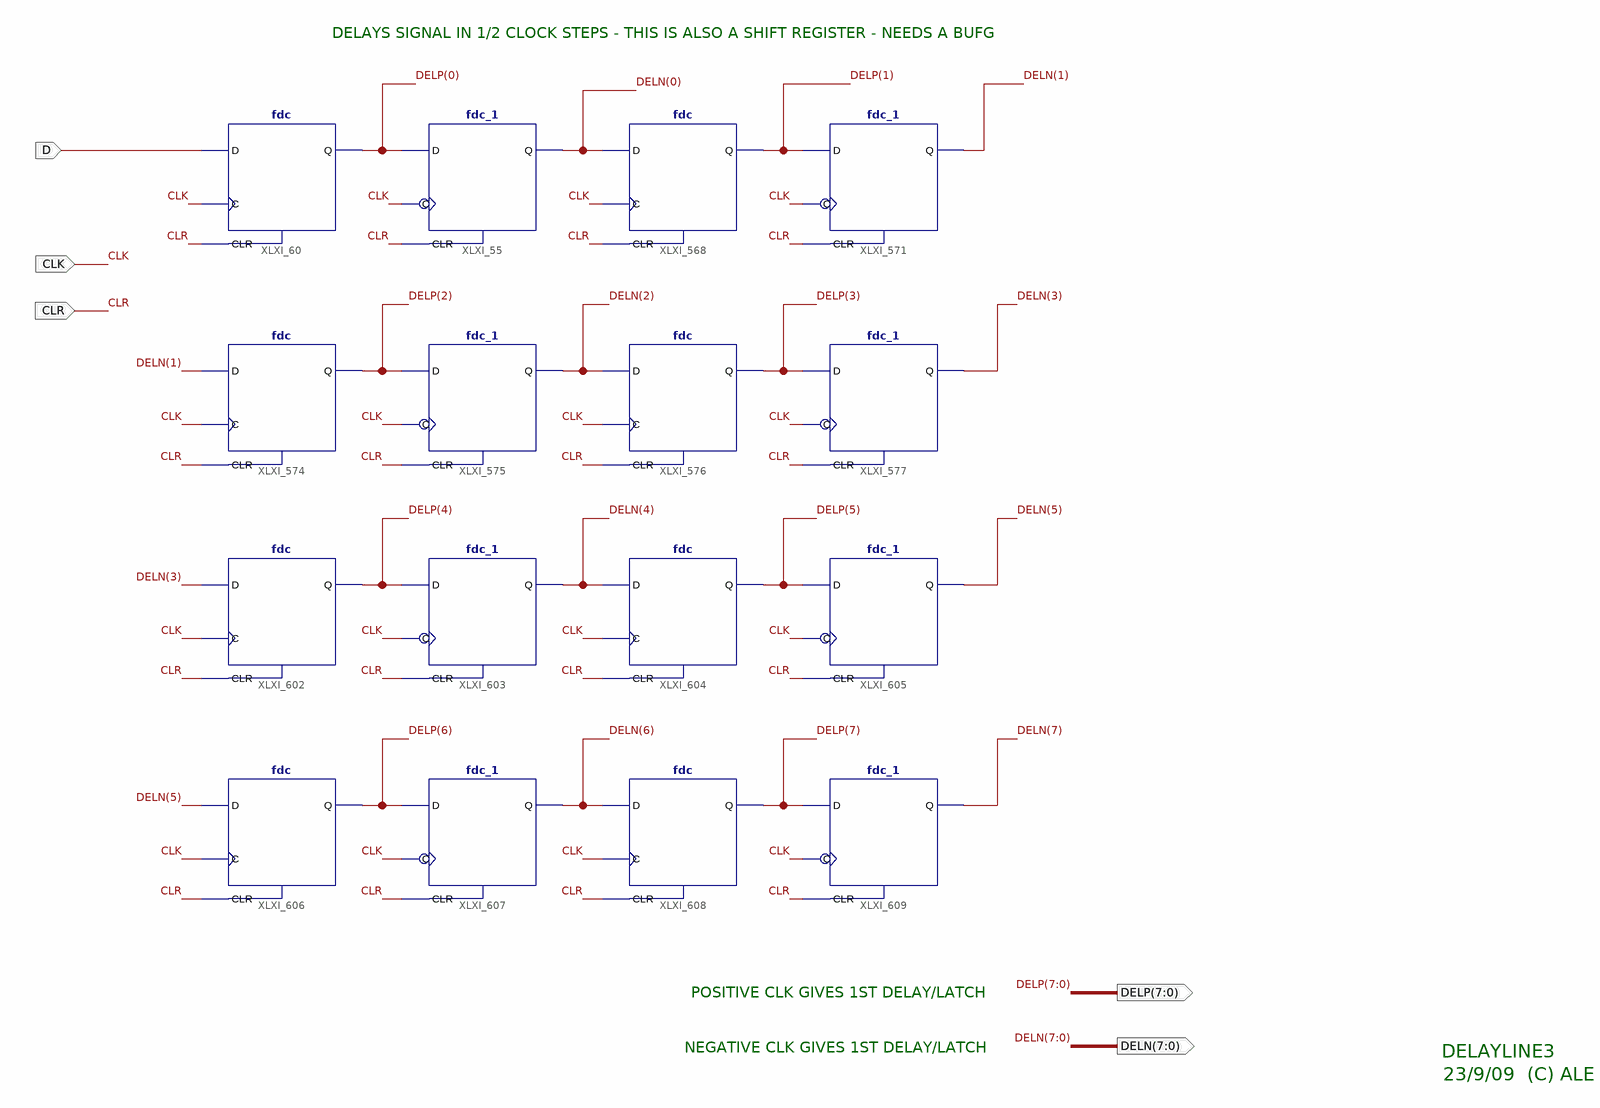
[diagram p0: schematic sheet 1]
// Xilinx ISE schematic DB_DelayLine3.sch (spartan3e) as structural Verilog: 16 symbols, 5 ports
module DB_DelayLine3 (
  input  CLK,
  input  CLR,
  input  D,
  output [7:0] DELP,
  output [7:0] DELN
);

  fdc XLXI_60 (.C(CLK), .CLR(CLR), .D(D), .Q(DELP[0]));
  fdc XLXI_568 (.C(CLK), .CLR(CLR), .D(DELN[0]), .Q(DELP[1]));
  fdc_1 XLXI_55 (.C(CLK), .CLR(CLR), .D(DELP[0]), .Q(DELN[0]));
  fdc_1 XLXI_571 (.C(CLK), .CLR(CLR), .D(DELP[1]), .Q(DELN[1]));
  fdc XLXI_574 (.C(CLK), .CLR(CLR), .D(DELN[1]), .Q(DELP[2]));
  fdc_1 XLXI_575 (.C(CLK), .CLR(CLR), .D(DELP[2]), .Q(DELN[2]));
  fdc XLXI_576 (.C(CLK), .CLR(CLR), .D(DELN[2]), .Q(DELP[3]));
  fdc_1 XLXI_577 (.C(CLK), .CLR(CLR), .D(DELP[3]), .Q(DELN[3]));
  fdc XLXI_602 (.C(CLK), .CLR(CLR), .D(DELN[3]), .Q(DELP[4]));
  fdc_1 XLXI_603 (.C(CLK), .CLR(CLR), .D(DELP[4]), .Q(DELN[4]));
  fdc XLXI_604 (.C(CLK), .CLR(CLR), .D(DELN[4]), .Q(DELP[5]));
  fdc_1 XLXI_605 (.C(CLK), .CLR(CLR), .D(DELP[5]), .Q(DELN[5]));
  fdc XLXI_606 (.C(CLK), .CLR(CLR), .D(DELN[5]), .Q(DELP[6]));
  fdc_1 XLXI_607 (.C(CLK), .CLR(CLR), .D(DELP[6]), .Q(DELN[6]));
  fdc XLXI_608 (.C(CLK), .CLR(CLR), .D(DELN[6]), .Q(DELP[7]));
  fdc_1 XLXI_609 (.C(CLK), .CLR(CLR), .D(DELP[7]), .Q(DELN[7]));

  // Notes on the sheet:
  //   DELAYS SIGNAL IN 1/2 CLOCK STEPS - THIS IS ALSO A SHIFT REGISTER - NEEDS A BUFG
  //   POSITIVE CLK GIVES 1ST DELAY/LATCH
  //   NEGATIVE CLK GIVES 1ST DELAY/LATCH
  //   DELAYLINE3
  //   23/9/09  (C) ALE
endmodule
